# EAGLE design Comparator Breakout TLV3501 (EAGLE 9.1.0)
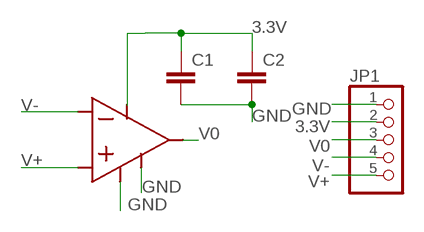
[diagram p0: schematic, sheet 1]

## Parts
C1  C-EUC0805  [C0805]
C2  C-EUC0805  [C0805]
JP1  PINHD-1X5  [1X05]
U$1  TLV3501  [SOT23-6]

## Nets
3.3V: C1.1 C2.1 JP1.2 U$1.P$4(V+)
GND: C1.2 C2.2 JP1.1 U$1.P$2(V-) U$1.P$6(SHDN)
V0: JP1.3 U$1.P$5(OUT)
V+: JP1.5 U$1.P$3(IN+)
V-: JP1.4 U$1.P$1(IN-)

## Library data of the parts
C1 C2 = rcl:C-EU: CAPACITOR, European symbol; SPICEPREFIX: C
JP1 = pinhead:PINHD-1X5: PIN HEADER
U$1 = Personal:TLV3501

## Board
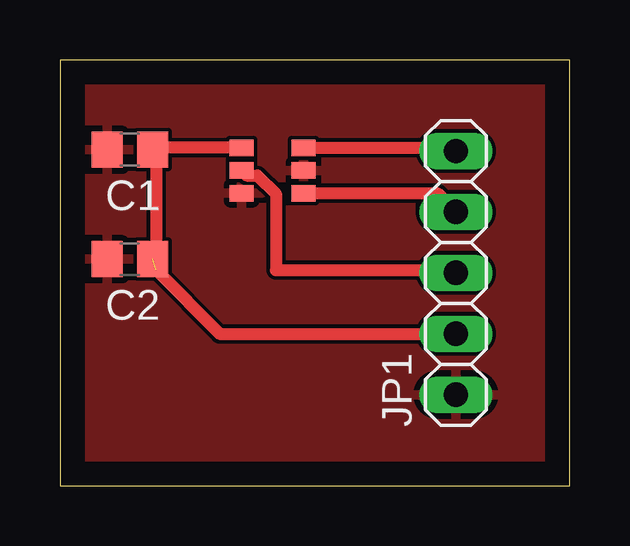
[diagram p1: board, top side]

Size 21.26 x 17.77 mm. Coordinates in mm from the lower left corner, seen from the top.
Outline: 0,0 21.26,0 21.26,17.77 0,17.77 0,0
Copper layers (1*16): Top 0.035mm / dielectric 1.5mm / Bottom 0.035mm
Design rules "default": minimum track width 6mil, minimum drill 0.35mm, track to track 6mil, track to pad 6mil, pad to pad 6mil, via to via 6mil, smd to smd 6mil, copper to edge 40mil, drill to drill 6mil, minimum pad ring 10mil, minimum via ring 8mil, stop-mask expansion 4mil, vias tented up to drill 0mil, thermal gap 10mil

### Footprints (pad centres in the part's own frame; a part is rotated, then mirrored left to right if it is on the bottom)
C0805 = smd 1.3 x 1.5: 1 -0.95,0; 2 0.95,0
1X05 = drill 1.016 long: 1 -5.08,0; 2 -2.54,0; 3 0,0; 4 2.54,0; 5 5.08,0
SOT23-6 = smd 0.69 x 0.99: P$1 1.9,0; P$2 0.95,0; P$3 0,0; P$4 0,-2.59; P$5 0.95,-2.59; P$6 1.9,-2.59

### Placement (x,y rotation side)
C1  2.92,14.03 180 top
C2  2.92,9.46 180 top
JP1  16.51,8.89 90 top
U$1  10.16,14.11 270 top

### Tracks (layer width: path | path; a pad name or v marks a point on that pad's centre or on a via)
3.3V  (1 unrouted)
  Top 0.5: U$1.P$4 3.95,14.11 C1.1 4,13.9 4,9 6.65,6.35 JP1.2
GND
  pour Top: 0,17 0,18 21,18 21,0 0,0
V0
  Top 0.5: U$1.P$5 7.77,12.96 8.23,12.96 9,12.19 9,9 16.4,9 JP1.3
V+
  Top 0.5: U$1.P$3 16.37,14.11 JP1.5
V-
  Top 0.5: U$1.P$1 15.73,12.21 JP1.4